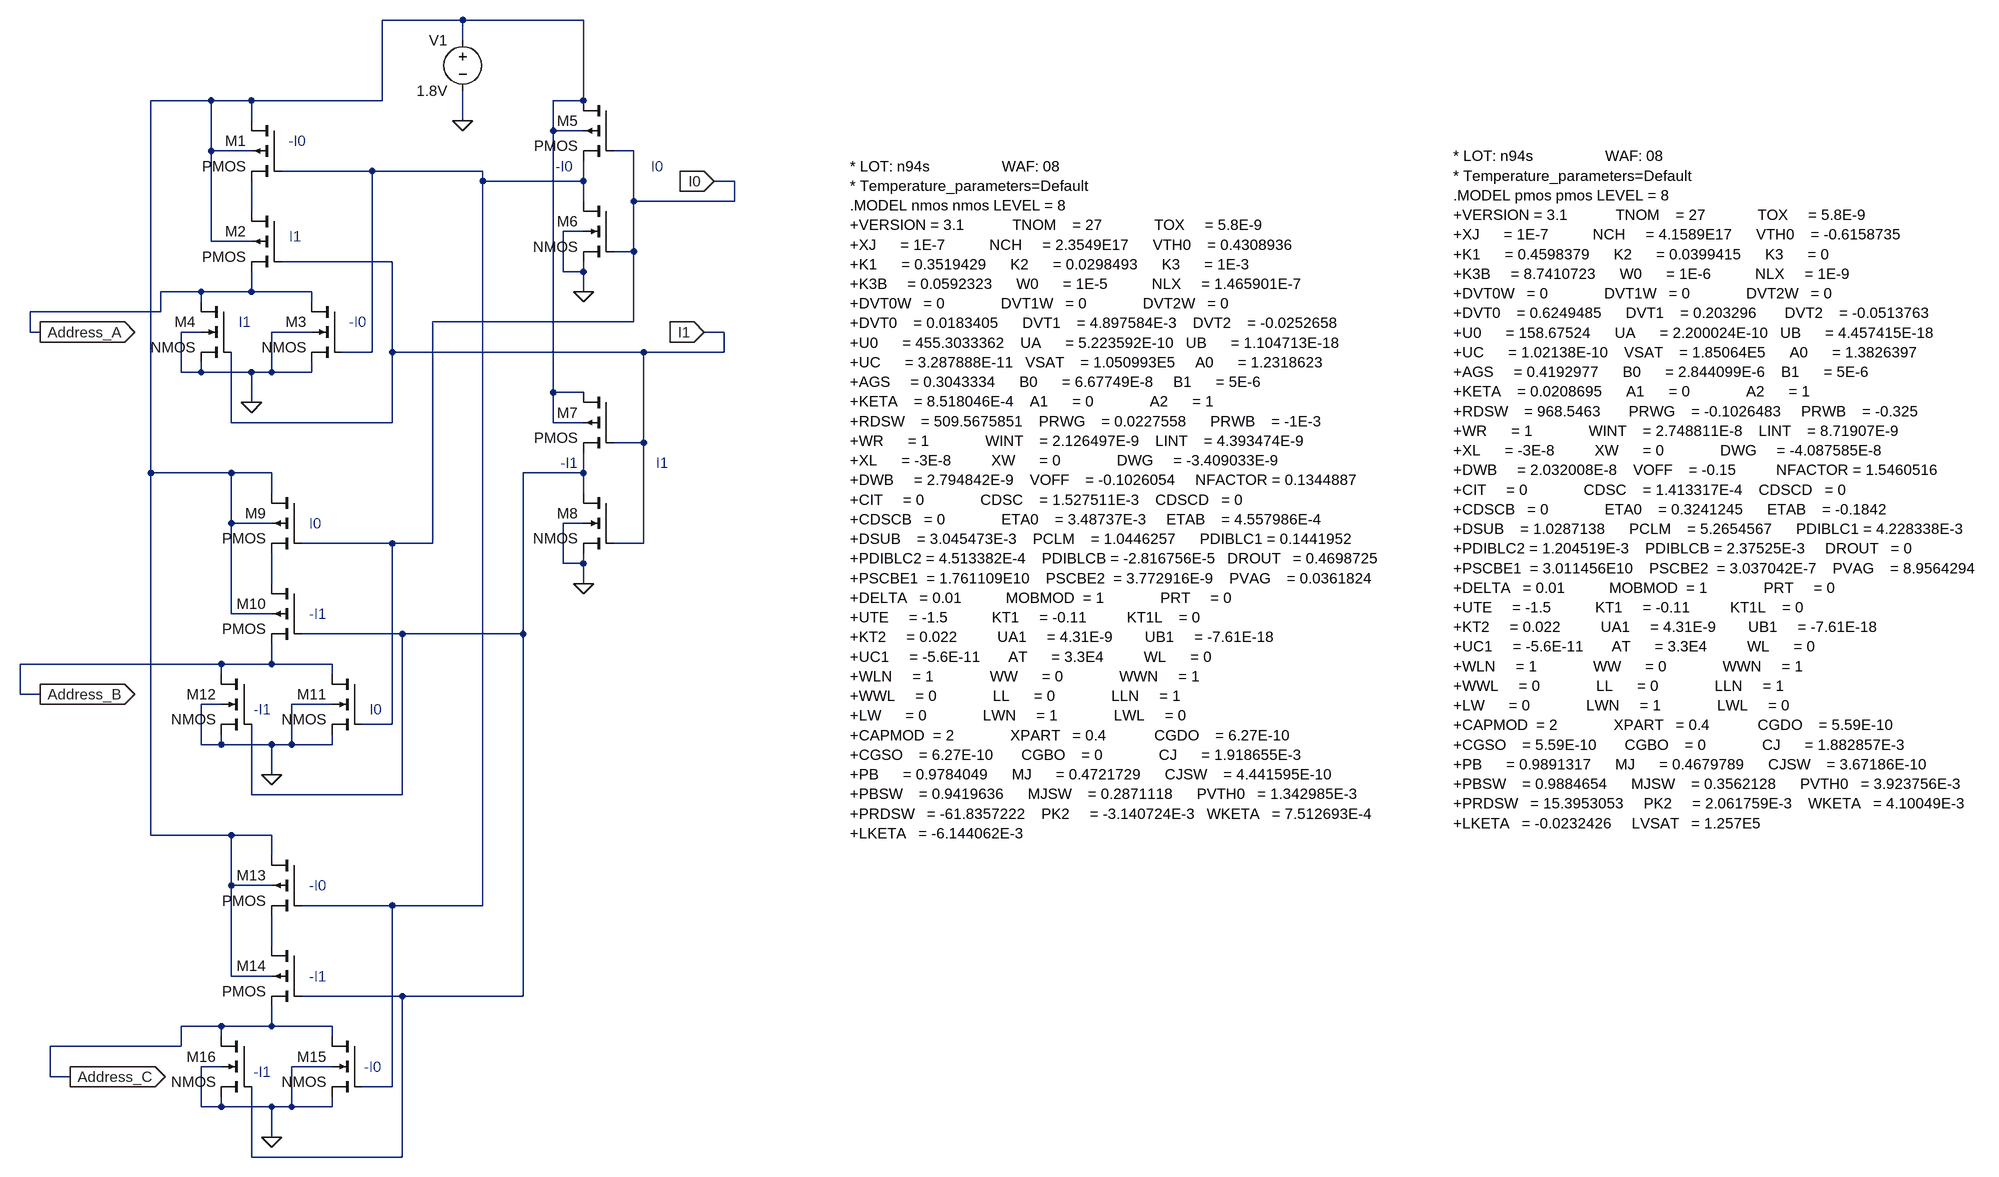
[diagram p0: schematic Address_decoder.asc]
Address_decoder.asc, the LTspice schematic file:
Version 4
SHEET 1 2520 1124
WIRE 64 -688 -64 -688
WIRE 256 -688 64 -688
WIRE 64 -656 64 -688
WIRE -336 -560 -432 -560
WIRE -272 -560 -336 -560
WIRE -64 -560 -64 -688
WIRE -64 -560 -272 -560
WIRE 256 -560 256 -688
WIRE 256 -560 208 -560
WIRE -272 -528 -272 -560
WIRE 64 -528 64 -576
WIRE 208 -512 208 -560
WIRE 256 -512 208 -512
WIRE -336 -480 -336 -560
WIRE -272 -480 -336 -480
WIRE 336 -480 304 -480
WIRE -80 -448 -224 -448
WIRE 96 -448 -80 -448
WIRE 96 -432 96 -448
WIRE 256 -432 256 -464
WIRE 256 -432 96 -432
WIRE 496 -432 464 -432
WIRE 256 -400 256 -432
WIRE 336 -400 336 -480
WIRE 496 -400 496 -432
WIRE 496 -400 336 -400
WIRE -272 -384 -272 -432
WIRE 256 -352 224 -352
WIRE -336 -336 -336 -480
WIRE -272 -336 -336 -336
WIRE 336 -320 336 -400
WIRE 336 -320 304 -320
WIRE -48 -304 -224 -304
WIRE 224 -288 224 -352
WIRE 256 -288 256 -304
WIRE 256 -288 224 -288
WIRE -352 -256 -416 -256
WIRE -272 -256 -272 -288
WIRE -272 -256 -352 -256
WIRE -176 -256 -272 -256
WIRE 256 -256 256 -288
WIRE -352 -240 -352 -256
WIRE -176 -240 -176 -256
WIRE -416 -224 -416 -256
WIRE -416 -224 -624 -224
WIRE 336 -208 336 -320
WIRE 336 -208 16 -208
WIRE -624 -192 -624 -224
WIRE -608 -192 -624 -192
WIRE -352 -192 -384 -192
WIRE -176 -192 -240 -192
WIRE 480 -192 448 -192
WIRE -80 -160 -80 -448
WIRE -80 -160 -128 -160
WIRE -48 -160 -48 -304
WIRE 352 -160 -48 -160
WIRE 480 -160 480 -192
WIRE 480 -160 352 -160
WIRE -384 -128 -384 -192
WIRE -352 -128 -352 -144
WIRE -352 -128 -384 -128
WIRE -272 -128 -352 -128
WIRE -240 -128 -240 -192
WIRE -240 -128 -272 -128
WIRE -176 -128 -176 -144
WIRE -176 -128 -240 -128
WIRE 208 -96 208 -512
WIRE 256 -96 208 -96
WIRE -272 -80 -272 -128
WIRE -304 -48 -304 -160
WIRE -48 -48 -48 -160
WIRE -48 -48 -304 -48
WIRE 208 -48 208 -96
WIRE 256 -48 208 -48
WIRE 352 -16 352 -160
WIRE 352 -16 304 -16
WIRE -432 32 -432 -560
WIRE -304 32 -432 32
WIRE -240 32 -304 32
WIRE 256 32 256 0
WIRE 256 32 160 32
WIRE -240 64 -240 32
WIRE 256 64 256 32
WIRE -304 112 -304 32
WIRE -240 112 -304 112
WIRE 256 112 224 112
WIRE -48 144 -192 144
WIRE 16 144 16 -208
WIRE 16 144 -48 144
WIRE 352 144 352 -16
WIRE 352 144 304 144
WIRE 224 176 224 112
WIRE 256 176 256 160
WIRE 256 176 224 176
WIRE -240 208 -240 160
WIRE 256 208 256 176
WIRE -304 256 -304 112
WIRE -240 256 -304 256
WIRE -32 288 -192 288
WIRE 160 288 160 32
WIRE 160 288 -32 288
WIRE -320 336 -640 336
WIRE -240 336 -240 304
WIRE -240 336 -320 336
WIRE -144 336 -240 336
WIRE -320 352 -320 336
WIRE -144 352 -144 336
WIRE -640 384 -640 336
WIRE -608 384 -640 384
WIRE -320 400 -352 400
WIRE -144 400 -208 400
WIRE -48 432 -48 144
WIRE -48 432 -96 432
WIRE -352 464 -352 400
WIRE -320 464 -320 448
WIRE -320 464 -352 464
WIRE -240 464 -320 464
WIRE -208 464 -208 400
WIRE -208 464 -240 464
WIRE -144 464 -144 448
WIRE -144 464 -208 464
WIRE -240 512 -240 464
WIRE -272 544 -272 432
WIRE -32 544 -32 288
WIRE -32 544 -272 544
WIRE -432 608 -432 32
WIRE -304 608 -432 608
WIRE -240 608 -304 608
WIRE -240 640 -240 608
WIRE -304 688 -304 608
WIRE -240 688 -304 688
WIRE -48 720 -192 720
WIRE 96 720 96 -432
WIRE 96 720 -48 720
WIRE -240 784 -240 736
WIRE -304 832 -304 688
WIRE -240 832 -304 832
WIRE -32 864 -192 864
WIRE 160 864 160 288
WIRE 160 864 -32 864
WIRE -320 912 -384 912
WIRE -240 912 -240 880
WIRE -240 912 -320 912
WIRE -144 912 -240 912
WIRE -320 928 -320 912
WIRE -144 928 -144 912
WIRE -384 944 -384 912
WIRE -384 944 -592 944
WIRE -320 976 -352 976
WIRE -144 976 -208 976
WIRE -592 992 -592 944
WIRE -560 992 -592 992
WIRE -48 1008 -48 720
WIRE -48 1008 -96 1008
WIRE -352 1040 -352 976
WIRE -320 1040 -320 1024
WIRE -320 1040 -352 1040
WIRE -240 1040 -320 1040
WIRE -208 1040 -208 976
WIRE -208 1040 -240 1040
WIRE -144 1040 -144 1024
WIRE -144 1040 -208 1040
WIRE -240 1088 -240 1040
WIRE -272 1120 -272 1008
WIRE -32 1120 -32 864
WIRE -32 1120 -272 1120
FLAG 64 -528 0
FLAG -272 -80 0
FLAG 256 -256 0
FLAG 256 208 0
FLAG -240 512 0
FLAG -240 1088 0
FLAG 464 -432 I0
IOPIN 464 -432 In
FLAG 448 -192 I1
IOPIN 448 -192 In
FLAG -608 -192 Address_A
IOPIN -608 -192 Out
FLAG -608 384 Address_B
IOPIN -608 384 Out
FLAG -560 992 Address_C
IOPIN -560 992 Out
SYMBOL voltage 64 -672 M0
WINDOW 123 0 0 Left 0
WINDOW 39 0 0 Left 0
SYMATTR InstName V1
SYMATTR Value 1.8V
SYMBOL pmos4 -224 -528 M0
SYMATTR InstName M1
SYMATTR Value2 l=180n w=3520n
SYMBOL pmos4 -224 -384 M0
SYMATTR InstName M2
SYMATTR Value2 l=180n w=3520n
SYMBOL nmos4 -128 -240 M0
SYMATTR InstName M3
SYMATTR Value2 l=180n w=1760n
SYMBOL nmos4 -304 -240 M0
SYMATTR InstName M4
SYMATTR Value2 l=180n w=1760n
SYMBOL pmos4 304 -560 M0
SYMATTR InstName M5
SYMATTR Value2 l=180n w=880n
SYMBOL nmos4 304 -400 M0
SYMATTR InstName M6
SYMATTR Value2 l=180n w=440n
SYMBOL pmos4 304 -96 M0
SYMATTR InstName M7
SYMATTR Value2 l=180n w=880n
SYMBOL nmos4 304 64 M0
SYMATTR InstName M8
SYMATTR Value2 l=180n w=440n
SYMBOL pmos4 -192 64 M0
SYMATTR InstName M9
SYMATTR Value2 l=180n w=3520n
SYMBOL pmos4 -192 208 M0
SYMATTR InstName M10
SYMATTR Value2 l=180n w=3520n
SYMBOL nmos4 -96 352 M0
SYMATTR InstName M11
SYMATTR Value2 l=180n w=1760n
SYMBOL nmos4 -272 352 M0
SYMATTR InstName M12
SYMATTR Value2 l=180n w=1760n
SYMBOL pmos4 -192 640 M0
SYMATTR InstName M13
SYMATTR Value2 l=180n w=3520n
SYMBOL pmos4 -192 784 M0
SYMATTR InstName M14
SYMATTR Value2 l=180n w=3520n
SYMBOL nmos4 -96 928 M0
SYMATTR InstName M15
SYMATTR Value2 l=180n w=1760n
SYMBOL nmos4 -272 928 M0
SYMATTR InstName M16
SYMATTR Value2 l=180n w=1760n
TEXT -192 -344 Right 2 ;I1
TEXT -272 -208 Right 2 ;I1
TEXT -184 -496 Right 2 ;-I0
TEXT -88 -208 Right 2 ;-I0
TEXT 384 -456 Right 2 ;I0
TEXT 392 16 Right 2 ;I1
TEXT 240 -456 Right 2 ;-I0
TEXT 248 16 Right 2 ;-I1
TEXT -160 112 Right 2 ;I0
TEXT -64 408 Right 2 ;I0
TEXT -152 256 Right 2 ;-I1
TEXT -240 408 Right 2 ;-I1
TEXT -152 832 Right 2 ;-I1
TEXT -240 984 Right 2 ;-I1
TEXT -152 688 Right 2 ;-I0
TEXT -64 976 Right 2 ;-I0
TEXT 680 -456 Left 2 !* LOT: n94s                  WAF: 08\n* Temperature_parameters=Default\n.MODEL nmos nmos LEVEL = 8\n+VERSION = 3.1            TNOM    = 27             TOX     = 5.8E-9\n+XJ      = 1E-7           NCH     = 2.3549E17      VTH0    = 0.4308936\n+K1      = 0.3519429      K2      = 0.0298493      K3      = 1E-3\n+K3B     = 0.0592323      W0      = 1E-5           NLX     = 1.465901E-7\n+DVT0W   = 0              DVT1W   = 0              DVT2W   = 0\n+DVT0    = 0.0183405      DVT1    = 4.897584E-3    DVT2    = -0.0252658\n+U0      = 455.3033362    UA      = 5.223592E-10   UB      = 1.104713E-18\n+UC      = 3.287888E-11   VSAT    = 1.050993E5     A0      = 1.2318623\n+AGS     = 0.3043334      B0      = 6.67749E-8     B1      = 5E-6\n+KETA    = 8.518046E-4    A1      = 0              A2      = 1\n+RDSW    = 509.5675851    PRWG    = 0.0227558      PRWB    = -1E-3\n+WR      = 1              WINT    = 2.126497E-9    LINT    = 4.393474E-9\n+XL      = -3E-8          XW      = 0              DWG     = -3.409033E-9\n+DWB     = 2.794842E-9    VOFF    = -0.1026054     NFACTOR = 0.1344887\n+CIT     = 0              CDSC    = 1.527511E-3    CDSCD   = 0\n+CDSCB   = 0              ETA0    = 3.48737E-3     ETAB    = 4.557986E-4\n+DSUB    = 3.045473E-3    PCLM    = 1.0446257      PDIBLC1 = 0.1441952\n+PDIBLC2 = 4.513382E-4    PDIBLCB = -2.816756E-5   DROUT   = 0.4698725\n+PSCBE1  = 1.761109E10    PSCBE2  = 3.772916E-9    PVAG    = 0.0361824\n+DELTA   = 0.01           MOBMOD  = 1              PRT     = 0\n+UTE     = -1.5           KT1     = -0.11          KT1L    = 0\n+KT2     = 0.022          UA1     = 4.31E-9        UB1     = -7.61E-18\n+UC1     = -5.6E-11       AT      = 3.3E4          WL      = 0\n+WLN     = 1              WW      = 0              WWN     = 1\n+WWL     = 0              LL      = 0              LLN     = 1\n+LW      = 0              LWN     = 1              LWL     = 0\n+CAPMOD  = 2              XPART   = 0.4            CGDO    = 6.27E-10\n+CGSO    = 6.27E-10       CGBO    = 0              CJ      = 1.918655E-3\n+PB      = 0.9784049      MJ      = 0.4721729      CJSW    = 4.441595E-10\n+PBSW    = 0.9419636      MJSW    = 0.2871118      PVTH0   = 1.342985E-3\n+PRDSW   = -61.8357222    PK2     = -3.140724E-3   WKETA   = 7.512693E-4\n+LKETA   = -6.144062E-3
TEXT 1640 -472 Left 2 !* LOT: n94s                  WAF: 08\n* Temperature_parameters=Default\n.MODEL pmos pmos LEVEL = 8\n+VERSION = 3.1            TNOM    = 27             TOX     = 5.8E-9\n+XJ      = 1E-7           NCH     = 4.1589E17      VTH0    = -0.6158735\n+K1      = 0.4598379      K2      = 0.0399415      K3      = 0\n+K3B     = 8.7410723      W0      = 1E-6           NLX     = 1E-9\n+DVT0W   = 0              DVT1W   = 0              DVT2W   = 0\n+DVT0    = 0.6249485      DVT1    = 0.203296       DVT2    = -0.0513763\n+U0      = 158.67524      UA      = 2.200024E-10   UB      = 4.457415E-18\n+UC      = 1.02138E-10    VSAT    = 1.85064E5      A0      = 1.3826397\n+AGS     = 0.4192977      B0      = 2.844099E-6    B1      = 5E-6\n+KETA    = 0.0208695      A1      = 0              A2      = 1\n+RDSW    = 968.5463       PRWG    = -0.1026483     PRWB    = -0.325\n+WR      = 1              WINT    = 2.748811E-8    LINT    = 8.71907E-9\n+XL      = -3E-8          XW      = 0              DWG     = -4.087585E-8\n+DWB     = 2.032008E-8    VOFF    = -0.15          NFACTOR = 1.5460516\n+CIT     = 0              CDSC    = 1.413317E-4    CDSCD   = 0\n+CDSCB   = 0              ETA0    = 0.3241245      ETAB    = -0.1842\n+DSUB    = 1.0287138      PCLM    = 5.2654567      PDIBLC1 = 4.228338E-3\n+PDIBLC2 = 1.204519E-3    PDIBLCB = 2.37525E-3     DROUT   = 0\n+PSCBE1  = 3.011456E10    PSCBE2  = 3.037042E-7    PVAG    = 8.9564294\n+DELTA   = 0.01           MOBMOD  = 1              PRT     = 0\n+UTE     = -1.5           KT1     = -0.11          KT1L    = 0\n+KT2     = 0.022          UA1     = 4.31E-9        UB1     = -7.61E-18\n+UC1     = -5.6E-11       AT      = 3.3E4          WL      = 0\n+WLN     = 1              WW      = 0              WWN     = 1\n+WWL     = 0              LL      = 0              LLN     = 1\n+LW      = 0              LWN     = 1              LWL     = 0\n+CAPMOD  = 2              XPART   = 0.4            CGDO    = 5.59E-10\n+CGSO    = 5.59E-10       CGBO    = 0              CJ      = 1.882857E-3\n+PB      = 0.9891317      MJ      = 0.4679789      CJSW    = 3.67186E-10\n+PBSW    = 0.9884654      MJSW    = 0.3562128      PVTH0   = 3.923756E-3\n+PRDSW   = 15.3953053     PK2     = 2.061759E-3    WKETA   = 4.10049E-3\n+LKETA   = -0.0232426     LVSAT   = 1.257E5

The netlist it stands for:
* Address_decoder.asc
V1 N001 0 1.8V
M1 N001 N002 N003 N001 PMOS l=180n w=3520n
M2 N003 I1 Address_A N001 PMOS l=180n w=3520n
M3 Address_A N002 0 0 NMOS l=180n w=1760n
M4 Address_A I1 0 0 NMOS l=180n w=1760n
M5 N001 I0 N002 N001 PMOS l=180n w=880n
M6 N002 I0 0 0 NMOS l=180n w=440n
M7 N001 I1 N004 N001 PMOS l=180n w=880n
M8 N004 I1 0 0 NMOS l=180n w=440n
M9 N001 I0 N005 N001 PMOS l=180n w=3520n
M10 N005 N004 Address_B N001 PMOS l=180n w=3520n
M11 Address_B I0 0 0 NMOS l=180n w=1760n
M12 Address_B N004 0 0 NMOS l=180n w=1760n
M13 N001 N002 N006 N001 PMOS l=180n w=3520n
M14 N006 N004 Address_C N001 PMOS l=180n w=3520n
M15 Address_C N002 0 0 NMOS l=180n w=1760n
M16 Address_C N004 0 0 NMOS l=180n w=1760n
.model NMOS NMOS
.model PMOS PMOS
.lib standard.mos
* I1
* I1
* -I0
* -I0
* I0
* I1
* -I0
* -I1
* I0
* I0
* -I1
* -I1
* -I1
* -I1
* -I0
* -I0
* LOT: n94s                  WAF: 08
* Temperature_parameters=Default
.MODEL nmos nmos LEVEL = 8
+VERSION = 3.1            TNOM    = 27             TOX     = 5.8E-9
+XJ      = 1E-7           NCH     = 2.3549E17      VTH0    = 0.4308936
+K1      = 0.3519429      K2      = 0.0298493      K3      = 1E-3
+K3B     = 0.0592323      W0      = 1E-5           NLX     = 1.465901E-7
+DVT0W   = 0              DVT1W   = 0              DVT2W   = 0
+DVT0    = 0.0183405      DVT1    = 4.897584E-3    DVT2    = -0.0252658
+U0      = 455.3033362    UA      = 5.223592E-10   UB      = 1.104713E-18
+UC      = 3.287888E-11   VSAT    = 1.050993E5     A0      = 1.2318623
+AGS     = 0.3043334      B0      = 6.67749E-8     B1      = 5E-6
+KETA    = 8.518046E-4    A1      = 0              A2      = 1
+RDSW    = 509.5675851    PRWG    = 0.0227558      PRWB    = -1E-3
+WR      = 1              WINT    = 2.126497E-9    LINT    = 4.393474E-9
+XL      = -3E-8          XW      = 0              DWG     = -3.409033E-9
+DWB     = 2.794842E-9    VOFF    = -0.1026054     NFACTOR = 0.1344887
+CIT     = 0              CDSC    = 1.527511E-3    CDSCD   = 0
+CDSCB   = 0              ETA0    = 3.48737E-3     ETAB    = 4.557986E-4
+DSUB    = 3.045473E-3    PCLM    = 1.0446257      PDIBLC1 = 0.1441952
+PDIBLC2 = 4.513382E-4    PDIBLCB = -2.816756E-5   DROUT   = 0.4698725
+PSCBE1  = 1.761109E10    PSCBE2  = 3.772916E-9    PVAG    = 0.0361824
+DELTA   = 0.01           MOBMOD  = 1              PRT     = 0
+UTE     = -1.5           KT1     = -0.11          KT1L    = 0
+KT2     = 0.022          UA1     = 4.31E-9        UB1     = -7.61E-18
+UC1     = -5.6E-11       AT      = 3.3E4          WL      = 0
+WLN     = 1              WW      = 0              WWN     = 1
+WWL     = 0              LL      = 0              LLN     = 1
+LW      = 0              LWN     = 1              LWL     = 0
+CAPMOD  = 2              XPART   = 0.4            CGDO    = 6.27E-10
+CGSO    = 6.27E-10       CGBO    = 0              CJ      = 1.918655E-3
+PB      = 0.9784049      MJ      = 0.4721729      CJSW    = 4.441595E-10
+PBSW    = 0.9419636      MJSW    = 0.2871118      PVTH0   = 1.342985E-3
+PRDSW   = -61.8357222    PK2     = -3.140724E-3   WKETA   = 7.512693E-4
+LKETA   = -6.144062E-3
* LOT: n94s                  WAF: 08
* Temperature_parameters=Default
.MODEL pmos pmos LEVEL = 8
+VERSION = 3.1            TNOM    = 27             TOX     = 5.8E-9
+XJ      = 1E-7           NCH     = 4.1589E17      VTH0    = -0.6158735
+K1      = 0.4598379      K2      = 0.0399415      K3      = 0
+K3B     = 8.7410723      W0      = 1E-6           NLX     = 1E-9
+DVT0W   = 0              DVT1W   = 0              DVT2W   = 0
+DVT0    = 0.6249485      DVT1    = 0.203296       DVT2    = -0.0513763
+U0      = 158.67524      UA      = 2.200024E-10   UB      = 4.457415E-18
+UC      = 1.02138E-10    VSAT    = 1.85064E5      A0      = 1.3826397
+AGS     = 0.4192977      B0      = 2.844099E-6    B1      = 5E-6
+KETA    = 0.0208695      A1      = 0              A2      = 1
+RDSW    = 968.5463       PRWG    = -0.1026483     PRWB    = -0.325
+WR      = 1              WINT    = 2.748811E-8    LINT    = 8.71907E-9
+XL      = -3E-8          XW      = 0              DWG     = -4.087585E-8
+DWB     = 2.032008E-8    VOFF    = -0.15          NFACTOR = 1.5460516
+CIT     = 0              CDSC    = 1.413317E-4    CDSCD   = 0
+CDSCB   = 0              ETA0    = 0.3241245      ETAB    = -0.1842
+DSUB    = 1.0287138      PCLM    = 5.2654567      PDIBLC1 = 4.228338E-3
+PDIBLC2 = 1.204519E-3    PDIBLCB = 2.37525E-3     DROUT   = 0
+PSCBE1  = 3.011456E10    PSCBE2  = 3.037042E-7    PVAG    = 8.9564294
+DELTA   = 0.01           MOBMOD  = 1              PRT     = 0
+UTE     = -1.5           KT1     = -0.11          KT1L    = 0
+KT2     = 0.022          UA1     = 4.31E-9        UB1     = -7.61E-18
+UC1     = -5.6E-11       AT      = 3.3E4          WL      = 0
+WLN     = 1              WW      = 0              WWN     = 1
+WWL     = 0              LL      = 0              LLN     = 1
+LW      = 0              LWN     = 1              LWL     = 0
+CAPMOD  = 2              XPART   = 0.4            CGDO    = 5.59E-10
+CGSO    = 5.59E-10       CGBO    = 0              CJ      = 1.882857E-3
+PB      = 0.9891317      MJ      = 0.4679789      CJSW    = 3.67186E-10
+PBSW    = 0.9884654      MJSW    = 0.3562128      PVTH0   = 3.923756E-3
+PRDSW   = 15.3953053     PK2     = 2.061759E-3    WKETA   = 4.10049E-3
+LKETA   = -0.0232426     LVSAT   = 1.257E5
.backanno
.end